# Altium project Sayma_AMC.PrjPcb (part 2 of 18)

## Sheet USB_SERIAL_QUAD.SchDoc: Sayma AMC
size 420 x 297 mm; $$Internal___BlkDate: 0:12:25_2-9-18; $$Internal_NAME_PLACEHOLDER: a3sheet; $$Internal_Resolution: 00001mm; $$NotCommonProperty_@NAME: USB_SERIAL_QUAD; $$NotCommonProperty_@PRINTORDER: 31; $$NotCommonProperty_@SHEET: 1; $$NotCommonProperty_@SHEETTOTAL: 30; CmpIndex: 15; Drawing Author: G.Kasprowicz; Drawing Number: Sayma AMC; Drawing Project: AMC FMC Carrier Board; Drawing Revision: 2.0; SymIndex: 2141; CheckedBy: P.Kulik,T.Przywozki,W.Ruclo; Author: G.Kasprowicz; CompanyName: WUT ISE; DrawnBy: G.Kasprowicz; Organization: WUT ISE; Address1: PW ISE; Address2: Nowowiejska 15/19 00-665 Warsaw; Address3: gkasprow@gmail.com; DocumentNumber: 20; Revision: 2; SheetNumber: 20; SheetTotal: 32; ModifiedBy: -; CheckedDate: -; Title2: Quad USB - serial; DivGrp: WUT ISE; Designer: G.Kasprowicz; ModifiedDate: -; ProjectName: Sensor Box
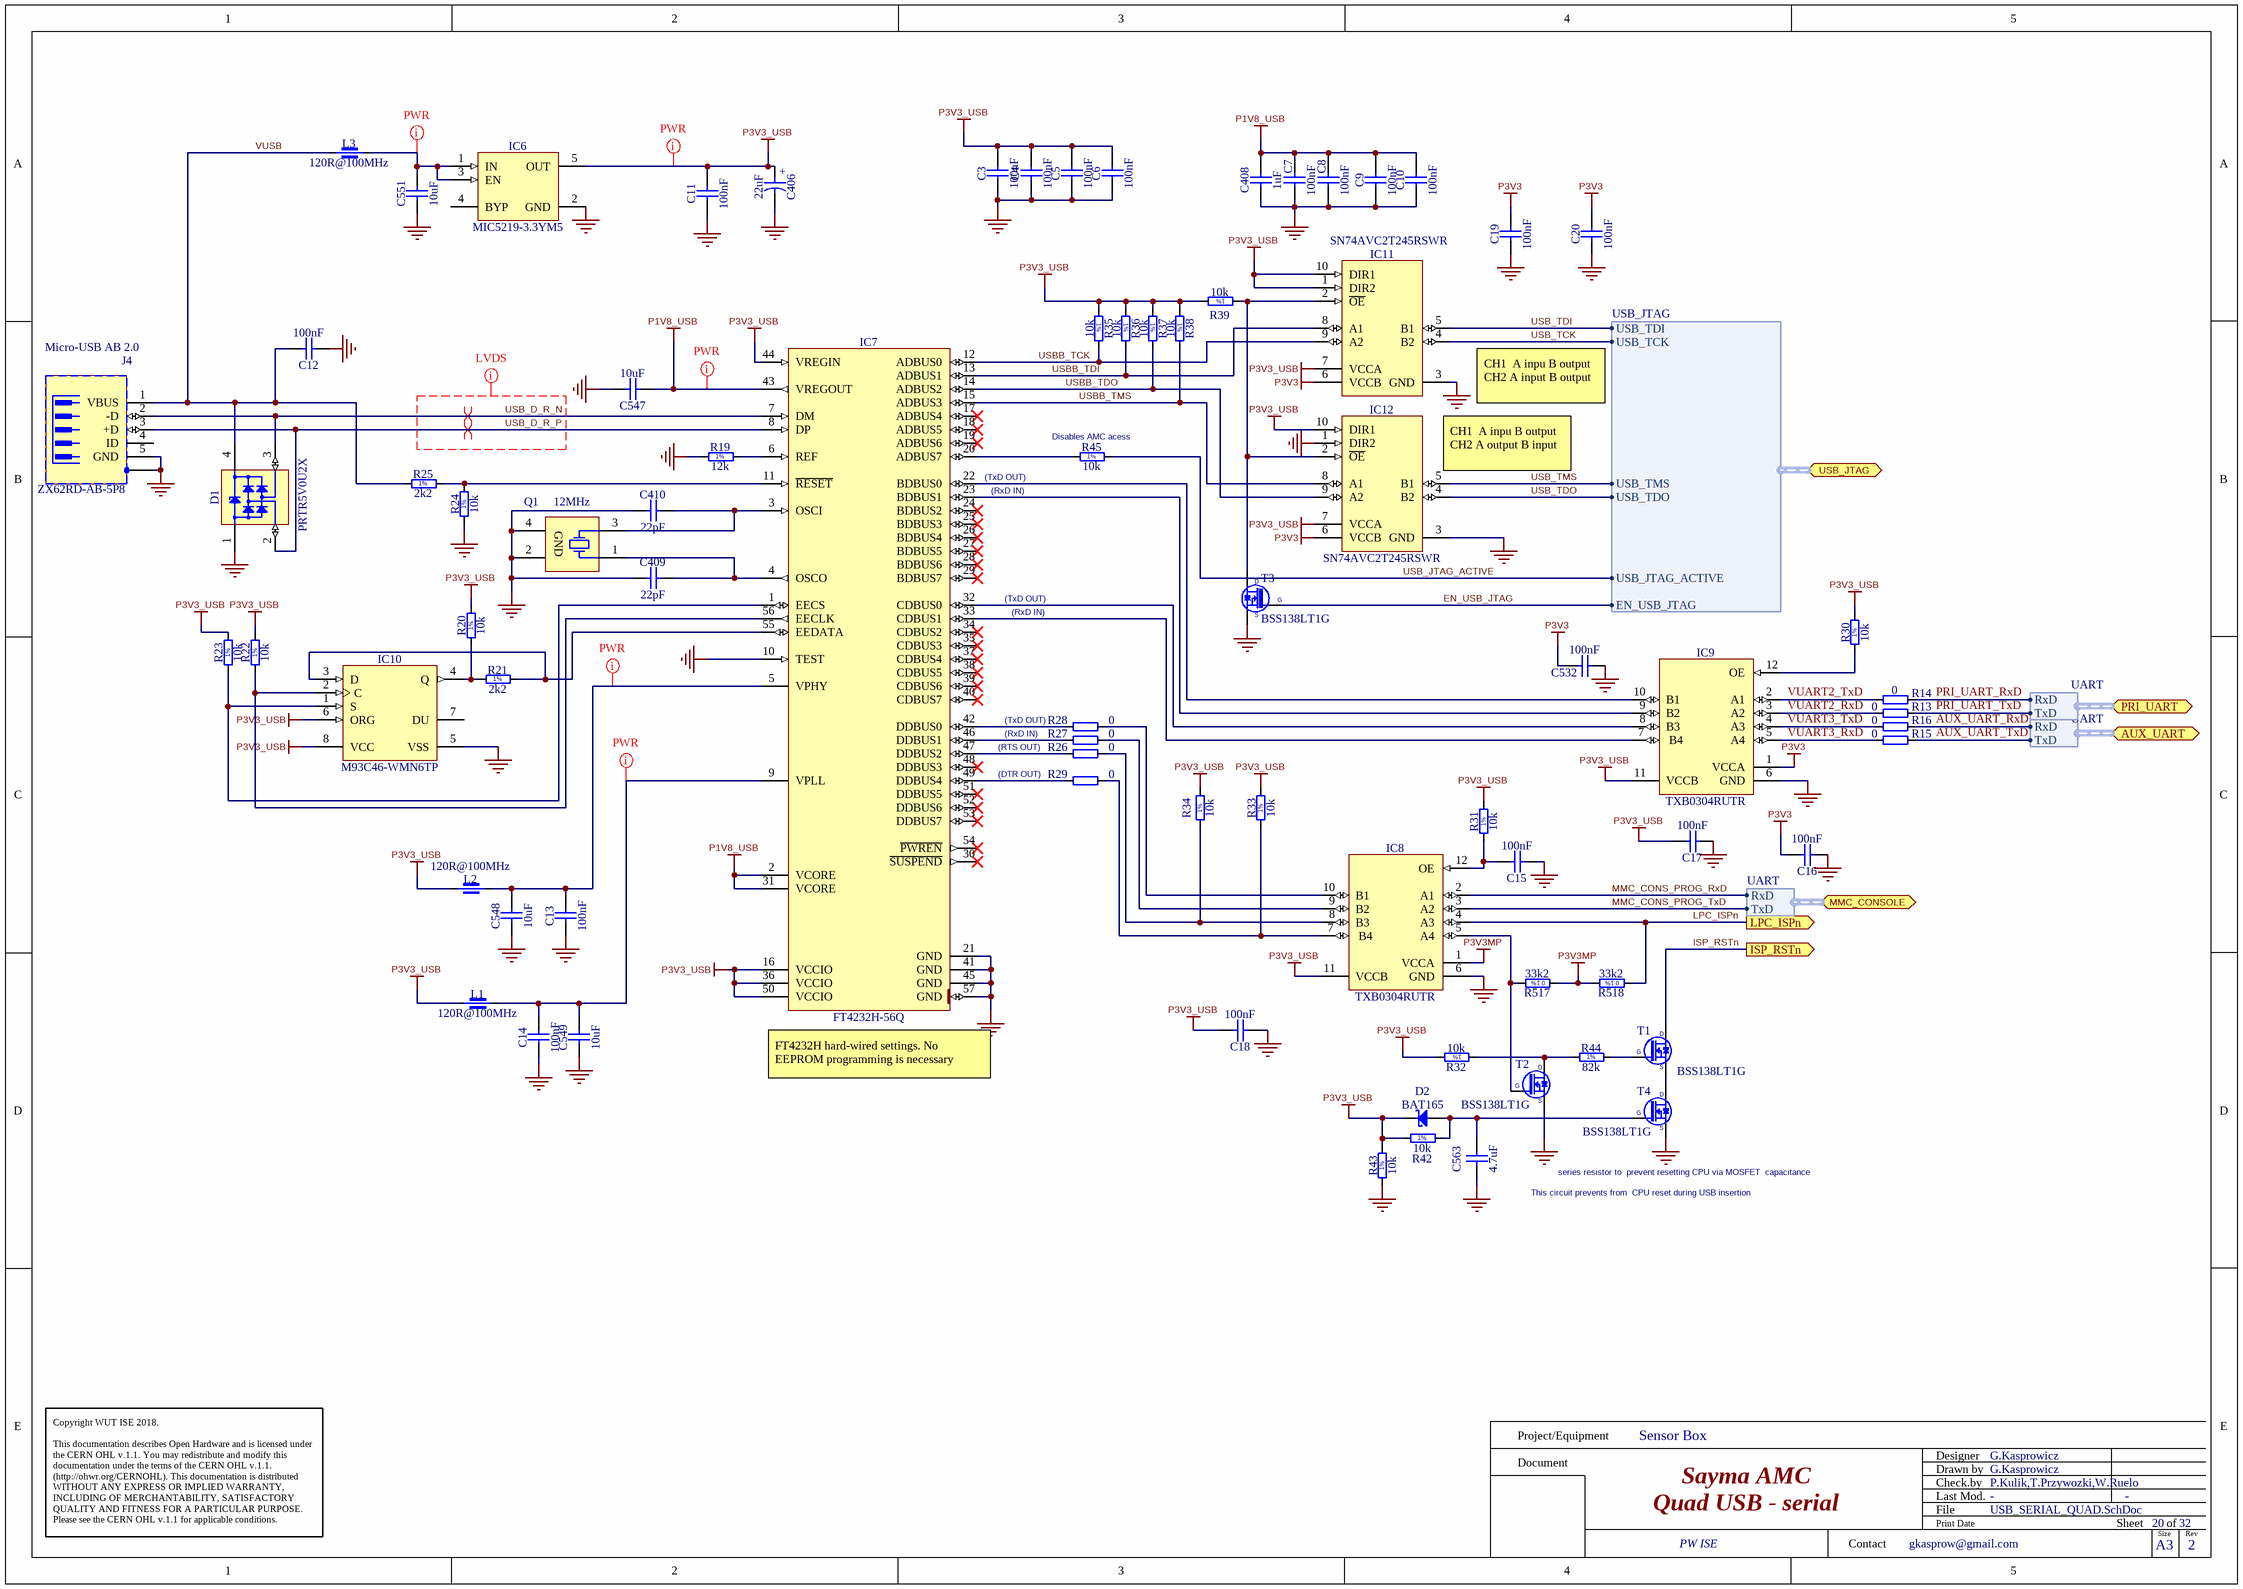
[diagram p1: USB_SERIAL_QUAD.SchDoc]

### Parts
C3  100nF  [CAPC0603X33N]
C4  100nF  [CAPC0603X33N]
C5  100nF  [CAPC0603X33N]
C6  100nF  [CAPC0603X33N]
C7  100nF  [CAPC0603X33N]
C8  100nF  [CAPC0603X33N]
C9  100nF  [CAPC0603X33N]
C10  100nF  [CAPC0603X33N]
C11  100nF  [CAPC0603X33N]
C12  100nF  [CAPC0603X33N]
C13  100nF  [CAPC0603X33N]
C14  100nF  [CAPC0603X33N]
C15  100nF  [CAPC0603X33N]
C16  100nF  [CAPC0603X33N]
C17  100nF  [CAPC0603X33N]
C18  100nF  [CAPC0603X33N]
C19  100nF  [CAPC0603X33N]
C20  100nF  [CAPC0603X33N]
C406  22uF  [CAPMP3216X180N]
C408  1uF  [CAPC1005X55N]
C409  22pF  [CAPC1005X55N]
C410  22pF  [CAPC1005X55N]
C532  100nF  [CAPC0603X33N]
C547  10uF  [CAPC1608X87N]
C548  10uF  [CAPC1608X87N]
C549  10uF  [CAPC1608X87N]
C551  10uF  [CAPC1608X87N]
C563  4.7uF  [CAPC1709X95N]
D1  PRTR5V0U2X  [SOT190P230X110-4N]
D2  BAT165  [SOD2512X110N]
IC6  MIC5219-3.3YM5  [SOT95P280X145-5N]
IC7  FT4232H-56Q  [QFN50P800X800X100-57N-S620]
IC8  TXB0304RUTR  [TEXAS_RUT (R-PUQFN-N12)]
IC9  TXB0304RUTR  [TEXAS_RUT (R-PUQFN-N12)]
IC10  M93C46-WMN6TP  [SOIC127P600X175-8N]
IC11  SN74AVC2T245RSWR  [QFN40P140X180X55-10N]
IC12  SN74AVC2T245RSWR  [QFN40P140X180X55-10N]
J4  Micro-USB AB 2.0  Manufacturer Part Number: ZX62RD-AB-5P8  [HIROSE_ZX62RD-AB-5P8]
L1  120R@100MHz  [INDC1608X65N]
L2  120R@100MHz  [INDC1608X65N]
L3  120R@100MHz  [INDC1608X65N]
Q1  12MHz  [XTAL_TXC_7M]
R13  0  [RESC1005X40N]
R14  0  [RESC1005X40N]
R15  0  [RESC1005X40N]
R16  0  [RESC1005X40N]
R19  12k  [RESC1005X40N]
R20  10k  [RESC1005X40N]
R21  2k2  [RESC1005X40N]
R22  10k  [RESC1005X40N]
R23  10k  [RESC1005X40N]
R24  10k  [RESC1005X40N]
R25  2k2  [RESC1005X40N]
R26  0  [RESC1005X40N]
R27  0  [RESC1005X40N]
R28  0  [RESC1005X40N]
R29  0  [RESC1005X40N]
R30  10k  [RESC1005X40N]
R31  10k  [RESC1005X40N]
R32  10k  [RESC1005X40N]
R33  10k  [RESC1005X40N]
R34  10k  [RESC1005X40N]
R35  10k  [RESC1005X40N]
R36  10k  [RESC1005X40N]
R37  10k  [RESC1005X40N]
R38  10k  [RESC1005X40N]
R39  10k  [RESC1005X40N]
R42  10k  [RESC1005X40N]
R43  10k  [RESC1005X40N]
R44  82k  [RESC1005X40N]
R45  10k  [RESC1005X40N]
R517  33k2  [RESC1608X55N]
R518  33k2  [RESC1608X55N]
T1  BSS138LT1G  [SOT95P240X110-3N]
T2  BSS138LT1G  [SOT95P240X110-3N]
T3  BSS138LT1G  [SOT95P240X110-3N]
T4  BSS138LT1G  [SOT95P240X110-3N]

### Ports
AUX_UART (bidir, harness UART), ISP_RSTn (out), LPC_ISPn (out), MMC_CONSOLE (bidir, harness UART), PRI_UART (bidir, harness UART), USB_JTAG (bidir, harness USB_JTAG)

### Harnesses
UART: RxD, TxD
USB_JTAG: USB_TDI, USB_TCK, USB_TMS, USB_TDO, USB_JTAG_ACTIVE, EN_USB_JTAG

### Nets
GND: C3.1 C4.1 C5.1 C6.1 C7.1 C8.1 C9.1 C10.1 C11.1 C12.1 C13.1 C14.1 C15.1 C16.1 C17.1 C18.1 C19.1 C20.1 C406.2 C408.2 C409.1 C410.1 C532.1 C547.2 C548.1 C549.1 C551.1 C563.1 D1.1(GND) IC6.2(GND) IC7.10(TEST) IC7.21(GND) IC7.41(GND) IC7.45(GND) IC7.57(GND) IC8.6(GND) IC9.6(GND) IC10.5(VSS) IC11.3(GND) IC12.1(DIR2) IC12.3(GND) J4.5(GND) J4.6(SH) Q1.2(GND) Q1.4(GND) R19.1 R24.1 R43.1 T2.2(S) T3.2(S) T4.2(S)
P1V8_USB: C7.2 C8.2 C9.2 C10.2 C408.1 C547.1 IC7.2(VCORE) IC7.31(VCORE) IC7.43(VREGOUT)
P3V3: C16.2 C19.2 C20.2 C532.2 IC9.1(VCCA) IC11.6(VCCB) IC12.6(VCCB)
P3V3_USB: C3.2 C4.2 C5.2 C6.2 C11.2 C17.2 C18.2 C406.1 D2.1(C) IC6.5(OUT) IC7.16(VCCIO) IC7.36(VCCIO) IC7.44(VREGIN) IC7.50(VCCIO) IC8.11(VCCB) IC9.11(VCCB) IC10.6(ORG) IC10.8(VCC) IC11.1(DIR2) IC11.7(VCCA) IC11.10(DIR1) IC12.7(VCCA) IC12.10(DIR1) L1.1 L2.1 R20.2 R22.2 R23.2 R30.2 R31.2 R32.2 R33.2 R34.2 R35.1 R36.1 R37.1 R38.1 R39.2 R42.1 R43.2
P3V3MP: IC8.1(VCCA) R517.1 R518.2
AUX_UART_RxD: R16.1 ; port AUX_UART.RxD
AUX_UART_TxD: R15.1 ; port AUX_UART.TxD
EN_USB_JTAG: T3.1(G) ; port USB_JTAG.EN_USB_JTAG
ISP_RSTn: T1.3(D) ; port ISP_RSTn
LPC_ISPn: IC8.4(A3) R518.1 ; port LPC_ISPn
MMC_CONS_PROG_RxD: IC8.2(A1) ; port MMC_CONSOLE.RxD
MMC_CONS_PROG_TxD: IC8.3(A2) ; port MMC_CONSOLE.TxD
PRI_UART_RxD: R14.1 ; port PRI_UART.RxD
PRI_UART_TxD: R13.1 ; port PRI_UART.TxD
USB_D_R_N: D1.3(I/O2) IC7.7(DM) J4.2(-D)
USB_D_R_P: D1.2(I/O1) IC7.8(DP) J4.3(+D)
USB_JTAG_ACTIVE: R45.2 ; port USB_JTAG.USB_JTAG_ACTIVE
USB_TCK: IC11.4(B2) ; port USB_JTAG.USB_TCK
USB_TDI: IC11.5(B1) ; port USB_JTAG.USB_TDI
USB_TDO: IC12.4(B2) ; port USB_JTAG.USB_TDO
USB_TMS: IC12.5(B1) ; port USB_JTAG.USB_TMS
USBB_TCK: IC7.12(ADBUS0) IC11.9(A2) R35.2
USBB_TDI: IC7.13(ADBUS1) IC11.8(A1) R36.2
USBB_TDO: IC7.14(ADBUS2) IC12.9(A2) R37.2
USBB_TMS: IC7.15(ADBUS3) IC12.8(A1) R38.2
VUART2_RxD: IC9.3(A2) R13.2
VUART2_TxD: IC9.2(A1) R14.2
VUART3_RxD: IC9.5(A4) R15.2
VUART3_TxD: IC9.4(A3) R16.2
VUSB: C12.2 D1.4(VCC) J4.1(VBUS) L3.1 R25.1
NetC13_2: C13.2 C548.2 IC7.5(VPHY) L2.2
NetC14_2: C14.2 C549.2 IC7.9(VPLL) L1.2
NetC15_2: C15.2 IC8.12(OE) R31.1
NetC409_2: C409.2 IC7.4(OSCO) Q1.1(X)
NetC410_2: C410.2 IC7.3(OSCI) Q1.3(X)
NetC551_2: C551.2 IC6.1(IN) IC6.3(EN) L3.2
NetC563_2: C563.2 D2.2(A) R42.2 T4.1(G)
NetIC7_1: IC7.1(EECS) IC10.1(S) R23.1
NetIC7_6: IC7.6(REF) R19.2
NetIC7_11: IC7.11(~{RESET}) R24.2 R25.2
NetIC7_20: IC7.20(ADBUS7) R45.1
NetIC7_22: IC7.22(BDBUS0) IC9.10(B1)
NetIC7_23: IC7.23(BDBUS1) IC9.9(B2)
NetIC7_32: IC7.32(CDBUS0) IC9.8(B3)
NetIC7_33: IC7.33(CDBUS1) IC9.7(B4)
NetIC7_42: IC7.42(DDBUS0) R28.1
NetIC7_46: IC7.46(DDBUS1) R27.1
NetIC7_47: IC7.47(DDBUS2) R26.1
NetIC7_49: IC7.49(DDBUS4) R29.1
NetIC7_55: IC7.55(EEDATA) IC10.3(D) R21.2
NetIC7_56: IC7.56(EECLK) IC10.2(C) R22.1
NetIC8_5: IC8.5(A4) R517.2 T2.1(G)
NetIC8_7: IC8.7(B4) R29.2 R33.1
NetIC8_8: IC8.8(B3) R26.2 R34.1
NetIC8_9: IC8.9(B2) R27.2
NetIC8_10: IC8.10(B1) R28.2
NetIC9_12: IC9.12(OE) R30.1
NetIC10_4: IC10.4(Q) R20.1 R21.1
NetIC11_2: IC11.2(~{OE}) IC12.2(~{OE}) R39.1 T3.3(D)
NetR32_1: R32.1 R44.1 T2.3(D)
NetR44_2: R44.2 T1.1(G)
NetT1_2: T1.2(S) T4.3(D)

Not connected (* = marked no-connect by the designer): IC6 4(BYP); IC7 17(ADBUS4)* 18(ADBUS5)* 19(ADBUS6)* 24(BDBUS2)* 25(BDBUS3)* 26(BDBUS4)* 27(BDBUS5)* 28(BDBUS6)* 29(BDBUS7)* 30(~{SUSPEND})* 34(CDBUS2)* 35(CDBUS3)* 37(CDBUS4)* 38(CDBUS5)* 39(CDBUS6)* 40(CDBUS7)* 48(DDBUS3)* 51(DDBUS5)* 52(DDBUS6)* 53(DDBUS7)* 54(~{PWREN})*; IC10 7(DU); J4 4(ID)

### Layout directives
net class PWR: NetC13_2, NetC14_2, NetC551_2, P1V8_USB, P3V3_USB
differential pair: USB_D_R_N, USB_D_R_P
net class LVDS: USB_D_R_N, USB_D_R_P

### Notes on the sheet
- CH1  A inpu B output
  CH2 A input B output
- (near R45) Disables AMC acess
- (near IC7) (TxD OUT)
- (RxD IN)
- (near IC12) CH1  A inpu B output
  CH2 A output B input
- (TxD OUT)
- (DTR OUT)
- (RTS OUT)
- (near IC7) FT4232H hard-wired settings. No EEPROM programming is necessary
- This circuit prevents from  CPU reset during USB insertion
- (near T4) series resistor to  prevent resetting CPU via MOSFET  capacitance
- Project/Equipment
- Document
- Designer
- Drawn by
- Check.by
- Copyright WUT ISE 2018.
  This documentation describes Open Hardware and is licensed under the CERN OHL v.1.1. You may redistribute and modify this documentation under the terms of the CERN OHL v.1.1. (http://ohwr.org/CERNOHL). This documentation is distributed WITHOUT ANY EXPRESS OR IMPLIED WARRANTY, INCLUDING OF MERCHANTABILITY, SATISFACTORY QUALITY AND FITNESS FOR A PARTICULAR PURPOSE. Please see the CERN OHL v.1.1 for applicable conditions.
- Contact
- File
- Last Mod.
- Print Date
- Sheet
- Size
- A3
- of
- Rev
- (in symbol CTE3216-18_22UF_6.3V_10%_LESR0900) +
- (in symbol R0402_2K2_1%_0.0625W_100PPM) 1%
- (in symbol R0402_10K_1%_0.0625W_100PPM) 1%
- (in symbol R0402_12K_1%_0.0625W_100PPM) 1%
- (in symbol R0402_82K_1%_0.0625W_100PPM) 1%
- (in symbol R0603_33K2_0.1%_0.063W_10PPM) 0.1%

### Library data of the parts
C3-C20 C532 = CC0201_100NF_6.3V_10%_X5R: Non-polarised capacitor; Manufacturer: GENERIC; Part Description: SMD Multilayer Chip Ceramic Capacitor; Manufacturer1 Part Number: 02016D104KAT2A; Tolerance: ±10%; Voltage: 6.3V; TC: X5R; Manufacturer Part Number: CC0201_100NF_6.3V_10%_X5R; Part Number: CC0201_100NF_6.3V_10%_X5R; Value: 100nF; Component Kind: Standard; Component Type: Standard; Pin Count: 2; Status: Not Recommended; Case: 0201; Mounted: Yes; Socket: No; SMD: Yes; Sense: No; Manufacturer1 Example: AVX; Manufacturer1 ComponentHeight: 0.33mm; HelpURL: \\cern.ch\dfs\Applications\Altium\Datasheets\CC0201_X5R_AVX.pdf; Author: CERN DEM JLC; CreateDate: 03.12.2007; LatestRevisionDate: 03.12.2007
C406 = CTE3216-18_22UF_6.3V_10%_LESR0900: Polarised capacitor; Manufacturer: GENERIC; Part Description: Low ESR 0R9 Solid Tantalum Chip Capacitor; Manufacturer1 Part Number: TPSA226K006R0900; Tolerance: ±10%; Voltage: 6.3V; Manufacturer Part Number: CTE3216-18_22UF_6.3V_10%_LESR0900; Part Number: CTE3216-18_22UF_6.3V_10%_LESR0900; Value: 22uF; Component Kind: Standard; Component Type: Standard; Pin Count: 2; Status: Preferred; Case: A; Mounted: Yes; Socket: No; SMD: Yes; Sense: No; Manufacturer1 Example: AVX; Manufacturer1 ComponentHeight: 1.8mm; HelpURL: \\cern.ch\dfs\Applications\Altium\Datasheets\CTE-LESR_AVX_TPS.pdf; Author: CERN DEM JLC; CreateDate: 05.05.2008; LatestRevisionDate: 20.01.2009
C408 = CC0402_1UF_16V_10%_X5R: Non-polarised capacitor; Manufacturer: GENERIC; Part Description: SMD Multilayer Chip Ceramic Capacitor; Manufacturer1 Part Number: C1005X5R1C105KT; Tolerance: ±10%; Voltage: 16V; TC: X5R; Manufacturer Part Number: CC0402_1UF_16V_10%_X5R; Part Number: CC0402_1UF_16V_10%_X5R; Value: 1uF; Component Kind: Standard; Component Type: Standard; Pin Count: 2; Status: Preferred; Case: 0402; Mounted: Yes; Socket: No; SMD: Yes; Sense: No; Manufacturer1 Example: TDK; Manufacturer1 ComponentHeight: 0.55mm; HelpURL: \\cern.ch\dfs\Applications\Altium\Datasheets\CC0402_X5R_TDK_C.pdf; Author: CERN DEM JLC; CreateDate: 25.10.2012; LatestRevisionDate: 25.10.2012
C409 C410 = CC0402_22PF_50V_5%_C0G: Non-polarised capacitor; Manufacturer: GENERIC; Part Description: SMD Multilayer Chip Ceramic Capacitor; Manufacturer1 Part Number: C0402C220J5GACTU; Tolerance: ±5%; Voltage: 50V; TC: C0G/NP0; Manufacturer Part Number: CC0402_22PF_50V_5%_C0G; Part Number: CC0402_22PF_50V_5%_C0G; Value: 22pF; Component Kind: Standard; Component Type: Standard; Pin Count: 2; Status: Preferred; Case: 0402; Mounted: Yes; Socket: No; SMD: Yes; Sense: No; Manufacturer1 Example: KEMET; Manufacturer1 ComponentHeight: 0.55mm; HelpURL: \\cern.ch\dfs\Applications\Altium\Datasheets\CC0805_C0G_KEMET_(Commercial Grade).pdf; Author: CERN DEM JLC; CreateDate: 03.12.2007; LatestRevisionDate: 03.12.2007
C547-C549 C551 = CC0603_10UF_6.3V_20%_X5R: Non-polarised capacitor; Manufacturer: GENERIC; Part Description: SMD Multilayer Chip Ceramic Capacitor; Manufacturer1 Part Number: C0603C106M9PAC; Tolerance: ±20%; Voltage: 6.3V; TC: X5R; Manufacturer Part Number: CC0603_10uF_6.3V_20%_X5R; Part Number: CC0603_10UF_6.3V_20%_X5R; Value: 10uF; Component Kind: Standard; Component Type: Standard; Pin Count: 2; Status: Preferred; Case: 0603; Mounted: Yes; Socket: No; SMD: Yes; Sense: No; Manufacturer1 Example: KEMET; Manufacturer1 ComponentHeight: 0.95mm; HelpURL: \\cern.ch\dfs\Applications\Altium\Datasheets\CC0603_X5R_KEMET.pdf; Author: CERN DEM JLC; CreateDate: 03.12.2007; LatestRevisionDate: 03.12.2007
C563 = CC0603_4.7UF_16V_10%_X5R: Non-polarised capacitor; Manufacturer: GENERIC; Part Description: SMD Multilayer Chip Ceramic Capacitor; Manufacturer1 Part Number: EMK107ABJ475KA-T; Tolerance: ±10%; Voltage: 16V; TC: X5R; Manufacturer Part Number: CC0603_4.7UF_16V_10%_X5R; Part Number: CC0603_4.7UF_16V_10%_X5R; Value: 4.7uF; Component Kind: Standard; Component Type: Standard; Pin Count: 2; Status: None; Case: 0603; Mounted: Yes; Socket: No; SMD: Yes; Sense: No; Manufacturer1 Example: TAIYO YUDEN; Manufacturer1 ComponentHeight: 0.95mm; HelpURL: \\cern.ch\dfs\Applications\Altium\Datasheets\CC0603_X7R_TAIYO-YUDEN_HIGH-VALUE.pdf; Author: CERN DEM JLC; CreateDate: 16.12.2013; LatestRevisionDate: 16.09.2014
D1 = PRTR5V0U2X: Ultra Low Capacitance Double Rail-to-Rail ESD Protection Diode; Manufacturer: NXP SEMICONDUCTORS; Part Description: Ultra Low Capacitance (1pF) Double Rail-to-Rail ESD Protection Diode (8kV); Voltage: 5.5V; PressFit: No; Bonding: No; Manufacturer Part Number: PRTR5V0U2X; PackageDescription: SOT143B, SOT, 1.90mm Pitch; 4 Pin, 1.30mm W X 2.90mm L X 1.10mm H body, IPC Medium Density; Part Number: PRTR5V0U2X; Component Kind: Standard; Component Type: Standard; Device: PRTR5V0U2X; Pin Count: 4; Case: SOT143B; Mounted: Yes; Socket: No; SMD: Yes; Sense: No; ComponentHeight: 1.1mm; HelpURL: \\cern.ch\dfs\Applications\Altium\Datasheets\PRTR5V0U2X.pdf; Author: CERN DEM JLC; CreateDate: 22.03.2011; LatestRevisionDate: 22.03.2011
D2 = BAT165: Schottky Diode; Manufacturer: INFINEON; Part Description: Medium Power AF Schottky Diode; Voltage: 40V; Power: 750mA; PressFit: No; Bonding: No; Manufacturer Part Number: BAT165; PackageDescription: Small Outline Diode (SOD-323), 1.70mm W X 1.25mm L X 1.10mm H body,  IPC Medium Density; Part Number: BAT165; Component Kind: Standard; Component Type: Standard; Device: BAT165; Pin Count: 2; Case: SOD323; Mounted: Yes; Socket: No; SMD: Yes; Sense: No; ComponentHeight: 1.1mm; HelpURL: \\cern.ch\dfs\Applications\Altium\Datasheets\BAT165.pdf; Author: CERN DEM JLC; CreateDate: 12.11.2014; LatestRevisionDate: 12.11.2014
IC6 = MIC5219-3.3YM5: 500mA Peak Output LDO Regulator; Part Description: 3.3V 500mA Peak Output Low Drop-Out  (LDO) Regulator; Manufacturer: MICROCHIP TECHNOLOGY; PressFit: No; Bonding: No; Part Number: MIC5219-3.3YM5; Component Kind: Standard; Component Type: Standard; Device: MIC5219-3.3YM5; PackageDescription: SOT, 0.95mm pitch; 5 pin, 1.60mm W X 2.90mm L X 1.45mm H body, IPC Medium Density; Manufacturer Part Number: MIC5219-3.3YM5; Pin Count: 5; Case: SOT23-5; Mounted: Yes; Socket: No; SMD: Yes; Sense: No; ComponentHeight: 1.45mm; HelpURL: \\cern.ch\dfs\Applications\Altium\Datasheets\MIC5219-3.3YM5.pdf; Author: CERN DEM WB; CreateDate: 16.04.2019; LatestRevisionDate: 16.04.2019
IC7 = FT4232H-56Q: Quad High Speed USB to Multipurpose UART/MPSSE IC; Manufacturer: FUTURE TECHNOLOGY DEVICES INTERNATIONAL (FTDI); PressFit: No; Bonding: No; Manufacturer Part Number: FT4232H-56Q; PackageDescription: QFN, 0.50mm Pitch, Square; 56 Pin, 8.00mm L X 8.00mm W X 1.00mm H body (6.1mm X 6.1mm Thermal tab), IPC Medium Density; Part Description: Quad High Speed USB to Multipurpose UART/MPSSE IC; Part Number: FT4232H-56Q; Component Kind: Standard; Component Type: Standard; Device: FT4232H-56Q; Pin Count: 57; Case: QFN56; Mounted: Yes; Socket: No; SMD: Yes; Sense: No; ComponentHeight: 1mm; Author: CERN DEM JLC; HelpURL: \\cern.ch\dfs\Applications\Altium\Datasheets\FT4232H-56Q.pdf; CreateDate: 11.10.2016; LatestRevisionDate: 11.10.2016
IC8 IC9 = TXB0304RUTR: 4-bit Bidirectional Auto-direction Sensing Translator with Fully Symmetric 0.9V to 3.6V Range; Manufacturer: TEXAS INSTRUMENTS; PressFit: No; Bonding: No; Manufacturer Part Number: TXB0304RUTR; PackageDescription: SON, TEXAS RUT (R-PUQFN-N12), 0.50mm Pitch, 12-pin, 1.70mm W  X 2.00mm L X 0.55mm Height; Part Description: 4-bit Bidirectional Auto-direction Sensing Translator with Fully Symmetric 0.9V to 3.6V Range; Part Number: TXB0304RUTR; Component Kind: Standard; Component Type: Standard; Device: TXB0304RUTR; Pin Count: 12; Case: QFN12; Mounted: Yes; Socket: No; SMD: Yes; Sense: No; ComponentHeight: 0.55mm; Author: CERN DEM JLC; HelpURL: \\cern.ch\dfs\Applications\Altium\Datasheets\TXB0304RUTR.pdf; CreateDate: 27.10.2014; LatestRevisionDate: 28.10.2014
IC10 = M93C46-WMN6TP: 2.5 to 5.5 V, 1Kb (128x8) Serial Microwire Bus EEPROM; Manufacturer: ST MICROELECTRONICS; Part Description: 1Kbit (128 x 8 bit or 64 x 16 bit) MICROWIRE® Serial Access EEPROM; PressFit: No; Bonding: No; Manufacturer Part Number: M93C46-WMN6TP; PackageDescription: SOIC 8, Pitch 1.27mm - Body 4x5mm, IPC Medium Density; Part Number: M93C46-WMN6TP; Component Kind: Standard; Component Type: Standard; Device: M93C46-WMN6TP; Pin Count: 8; Case: SOIC8; Mounted: Yes; Socket: No; SMD: Yes; Sense: No; ComponentHeight: 1.75mm; HelpURL: \\cern.ch\dfs\Applications\Altium\Datasheets\M93C46-WMN6TP.pdf; Author: CERN DEM JLC; CreateDate: 15.11.2012; LatestRevisionDate: 15.11.2012
IC11 IC12 = SN74AVC2T245RSWR: Dual-Bit Dual-Supply Bus Transceiver With Configurable Voltage Translation and 3-State Outputs; Manufacturer: TEXAS INSTRUMENTS; PressFit: No; Bonding: No; Manufacturer Part Number: SN74AVC2T245RSWR; PackageDescription: QFN, 0.40mm Pitch, Rect.;10 Pin, 1.80mm L X 1.40mm W X 0.55mm H Body, IPC Medium Density; Part Description: Dual-Bit Dual-Supply Bus Transceiver With Configurable Voltage Translation and 3-State Outputs; Part Number: SN74AVC2T245RSWR; Component Kind: Standard; Component Type: Standard; Device: SN74AVC2T245RSWR; Status: Not Recommended; Pin Count: 10; Case: QFN10; Mounted: Yes; Socket: No; SMD: Yes; Sense: No; ComponentHeight: 0.55mm; Author: CERN DEM JLC; HelpURL: \\cern.ch\dfs\Applications\Altium\Datasheets\SN74AVC2T245RSWR.pdf; CreateDate: 07.07.2014; LatestRevisionDate: 30.03.2017
J4 = HIROSE_ZX62RD-AB-5P8: 5 Pin + 1 Shield USB Receptacle; Manufacturer: HIROSE (HRS); Part Description: Micro-USB 2.0 Right Angle, SMD Type AB - Reverse (Top mount), Shell Through Hole; PressFit: No; Part Number: HIROSE_ZX62RD-AB-5P8; Component Kind: Standard; Component Type: Standard; Pin Count: 7; Family: Micro-USB AB 2.0; Mounted: Yes; Socket: No; SMD: Yes; Sense: No; Status: Obsolete; ComponentHeight: 2.35mm; HelpURL: \\cern.ch\dfs\Applications\Altium\Datasheets\HIROSE_ZX62RD-AB-5P8.pdf; ComponentLink1URL: \\cern.ch\dfs\Applications\Altium\Datasheets\HIROSE_ZX62RD-AB-5P8_Package-Drawing.pdf; ComponentLink1Description: Package-Drawing; Author: CERN DEM JLC; CreateDate: 29.10.2014; LatestRevisionDate: 22.06.2017
L1-L3 = IND0603_MURATA_BLM18SG121TN1D: Manufacturer: MURATA; Part Description: SMD EMIFIL Suppression Chip Ferrite Bead; Tolerance: ±25%; Power: 3A; Resistance: 0.025R; Manufacturer Part Number: BLM18SG121TN1D; Part Number: IND0603_MURATA_BLM18SG121TN1D; Value: 120R@100MHz; Component Kind: Standard; Component Type: Standard; Pin Count: 2; Status: None; Case: 0603; Mounted: Yes; Socket: No; SMD: Yes; Sense: No; ComponentHeight: 0.65mm; HelpURL: \\cern.ch\dfs\Applications\Altium\Datasheets\IND0603_MURATA_BLM18S.pdf; Author: CERN DEM JLC; CreateDate: 23.07.2014; LatestRevisionDate: 25.10.2018
Q1 = XTAL_12MHZ_TXC_7M-12.000MAAJ-T: Crystal 4 pins 1=XTAL Control 2=GND3=XTAL 4=GND; Manufacturer: TXC CORPORATION; Part Description: ±30ppm 18pF -20°C to +70°C  4 Pins, 3.2x2.5X0.8mm, SMD Sealing Crystal, 7M Series; PressFit: No; Bonding: No; Manufacturer Part Number: 7M-12.000MAAJ-T; PackageDescription: 4 Pins, 2.5x3.2mm, SMD Sealing Crystal, 7M Serie; Part Number: XTAL_12MHZ_TXC_7M-12.000MAAJ-T; Value: 12MHz; Component Kind: Standard; Component Type: Standard; Pin Count: 4; Mounted: Yes; Socket: No; SMD: Yes; Sense: No; ComponentHeight: 0.8mm; HelpURL: \\cern.ch\dfs\Applications\Altium\Datasheets\XTAL_TXC_7M.pdf; Author: CERN DEM JLC; CreateDate: 19.06.2012; LatestRevisionDate: 19.06.2012
R13-R16 R26-R29 = R0402_0R_JUMPER: as R1 on sheet Sayma_AMC; Manufacturer Part Number: R0402_0R_JUMPER; Part Number: R0402_0R_JUMPER; Value: 0; Component Kind: Standard; Component Type: Standard; Pin Count: 2; Status: Not Recommended; Case: 0402; Mounted: Yes; Sense: No; Socket: No; SMD: Yes; Manufacturer1 Example: YAGEO PHYCOMP; Manufacturer1 ComponentHeight: 0.4mm; HelpURL: \\cern.ch\dfs\Applications\Altium\Datasheets\R0402_Phycomp_RC0402.pdf; Author: CERN DEM JLC; CreateDate: 03.12.2007; LatestRevisionDate: 17.10.2012
R19 = R0402_12K_1%_0.0625W_100PPM: Resistor - 1%; Manufacturer: GENERIC; Part Description: General Purpose Thick Film Chip Resistor; Manufacturer1 Part Number: 232270671203L; TC: ±100ppm/°C; PressFit: No; Manufacturer Part Number: R0402_12K_1%_0.0625W_100PPM; Part Number: R0402_12K_1%_0.0625W_100PPM; Tolerance: ±1%; Value: 12k; Component Kind: Standard; Component Type: Standard; Pin Count: 2; Status: Not Recommended; Power: 0.0625W; Case: 0402; Mounted: Yes; Sense: No; Socket: No; SMD: Yes; Manufacturer1 Example: YAGEO PHYCOMP; Manufacturer1 ComponentHeight: 0.4mm; HelpURL: \\cern.ch\dfs\Applications\Altium\Datasheets\R0402_Phycomp_RC0402.pdf; Author: CERN DEM JLC; CreateDate: 03.12.2007; LatestRevisionDate: 17.10.2012
R20 R22-R24 R30-R39 R42 R43 R45 = R0402_10K_1%_0.0625W_100PPM: Resistor - 1%; Manufacturer: GENERIC; Part Description: General Purpose Thick Film Chip Resistor; Manufacturer1 Part Number: 232270671003L; TC: ±100ppm/°C; PressFit: No; Manufacturer Part Number: R0402_10K_1%_0.0625W_100PPM; Part Number: R0402_10K_1%_0.0625W_100PPM; Tolerance: ±1%; Value: 10k; Component Kind: Standard; Component Type: Standard; Pin Count: 2; Status: Not Recommended; Power: 0.0625W; Case: 0402; Mounted: Yes; Sense: No; Socket: No; SMD: Yes; Manufacturer1 Example: YAGEO PHYCOMP; Manufacturer1 ComponentHeight: 0.4mm; HelpURL: \\cern.ch\dfs\Applications\Altium\Datasheets\R0402_Phycomp_RC0402.pdf; Author: CERN DEM JLC; CreateDate: 03.12.2007; LatestRevisionDate: 17.10.2012
R21 R25 = R0402_2K2_1%_0.0625W_100PPM: Resistor - 1%; Manufacturer: GENERIC; Part Description: General Purpose Thick Film Chip Resistor; Manufacturer1 Part Number: 232270672202L; TC: ±100ppm/°C; PressFit: No; Manufacturer Part Number: R0402_2K2_1%_0.0625W_100PPM; Part Number: R0402_2K2_1%_0.0625W_100PPM; Tolerance: ±1%; Value: 2k2; Component Kind: Standard; Component Type: Standard; Pin Count: 2; Status: Not Recommended; Power: 0.0625W; Case: 0402; Mounted: Yes; Sense: No; Socket: No; SMD: Yes; Manufacturer1 Example: YAGEO PHYCOMP; Manufacturer1 ComponentHeight: 0.4mm; HelpURL: \\cern.ch\dfs\Applications\Altium\Datasheets\R0402_Phycomp_RC0402.pdf; Author: CERN DEM JLC; CreateDate: 03.12.2007; LatestRevisionDate: 17.10.2012
R44 = R0402_82K_1%_0.0625W_100PPM: Resistor - 1%; Manufacturer: GENERIC; Part Description: General Purpose Thick Film Chip Resistor; Manufacturer1 Part Number: 232270678203L; TC: ±100ppm/°C; PressFit: No; Manufacturer Part Number: R0402_82K_1%_0.0625W_100PPM; Part Number: R0402_82K_1%_0.0625W_100PPM; Tolerance: ±1%; Value: 82k; Component Kind: Standard; Component Type: Standard; Pin Count: 2; Status: Not Recommended; Power: 0.0625W; Case: 0402; Mounted: Yes; Sense: No; Socket: No; SMD: Yes; Manufacturer1 Example: YAGEO PHYCOMP; Manufacturer1 ComponentHeight: 0.4mm; HelpURL: \\cern.ch\dfs\Applications\Altium\Datasheets\R0402_Phycomp_RC0402.pdf; Author: CERN DEM JLC; CreateDate: 03.12.2007; LatestRevisionDate: 17.10.2012
R517 R518 = R0603_33K2_0.1%_0.063W_10PPM: Resistor - 0.1%; Manufacturer: GENERIC; Part Description: Thin Film Chip Resistor; Manufacturer1 Part Number: RN73C1J33K2BTDF; Power: 0.063W; TC: ±10ppm; PressFit: No; Manufacturer Part Number: R0603_33K2_0.1%_0.063W_10PPM; Part Number: R0603_33K2_0.1%_0.063W_10PPM; Tolerance: ±0.1%; Value: 33k2; Component Kind: Standard; Component Type: Standard; Pin Count: 2; Status: Not Recommended; Case: 0603; Mounted: Yes; Sense: No; Socket: No; SMD: Yes; Manufacturer1 Example: TYCO HOLSWORTHY; Manufacturer1 ComponentHeight: 0.5mm; HelpURL: \\cern.ch\dfs\Applications\Altium\Datasheets\R0603_Tyco_RN73.pdf; Author: CERN DEM JLC; CreateDate: 03.12.2007; LatestRevisionDate: 13.03.2008
T1-T4 = BSS138LT1G: N-CHANNEL MOSFET WITH DIODE; Manufacturer: ON SEMICONDUCTOR; Part Description: 50V 200mA N-Channel Enhancement Mode Field-Effect Transistor; PressFit: No; Bonding: No; Manufacturer Part Number: BSS138LT1G; PackageDescription: SOT23 3-Leads, Pitch 0.95mm - Body 1.4x3mm, IPC Medium Density; Part Number: BSS138LT1G; Component Kind: Standard; Component Type: Standard; Device: BSS138LT1G; Pin Count: 3; Case: SOT23-3; Mounted: Yes; Socket: No; SMD: Yes; Sense: No; ComponentHeight: 1.11mm; HelpURL: \\cern.ch\dfs\Applications\Altium\Datasheets\BSS138LT1G.pdf; Author: CERN DEM JLC; CreateDate: 23.03.2009; LatestRevisionDate: 23.03.2009

## Sheet AMC_Connector.SchDoc: Sayma AMC
size 420 x 297 mm; $$Internal___BlkDate: 0:12:25_2-9-18; $$Internal_NAME_PLACEHOLDER: a3sheet; $$Internal_Resolution: 00001mm; $$NotCommonProperty_@NAME: AMC_Connector; $$NotCommonProperty_@PRINTORDER: 7; $$NotCommonProperty_@SHEET: 1; $$NotCommonProperty_@SHEETTOTAL: 30; CmpIndex: 8; Drawing Author: G.Kasprowicz; Drawing Number: Sayma AMC; Drawing Project: AMC FMC Carrier Board; Drawing Revision: 2.0; SymIndex: 2141; CheckedBy: P.Kulik,T.Przywozki,W.Ruclo; Author: G.Kasprowicz; CompanyName: WUT ISE; DrawnBy: G.Kasprowicz; Organization: WUT ISE; Address1: PW ISE; Address2: Nowowiejska 15/19 00-665 Warsaw; Address3: gkasprow@gmail.com; DocumentNumber: 2; Revision: 2; SheetNumber: 2; SheetTotal: 32; ModifiedBy: -; CheckedDate: -; Title2: AMC connector; DivGrp: WUT ISE; Designer: G.Kasprowicz; ModifiedDate: -; ProjectName: Sensor Box
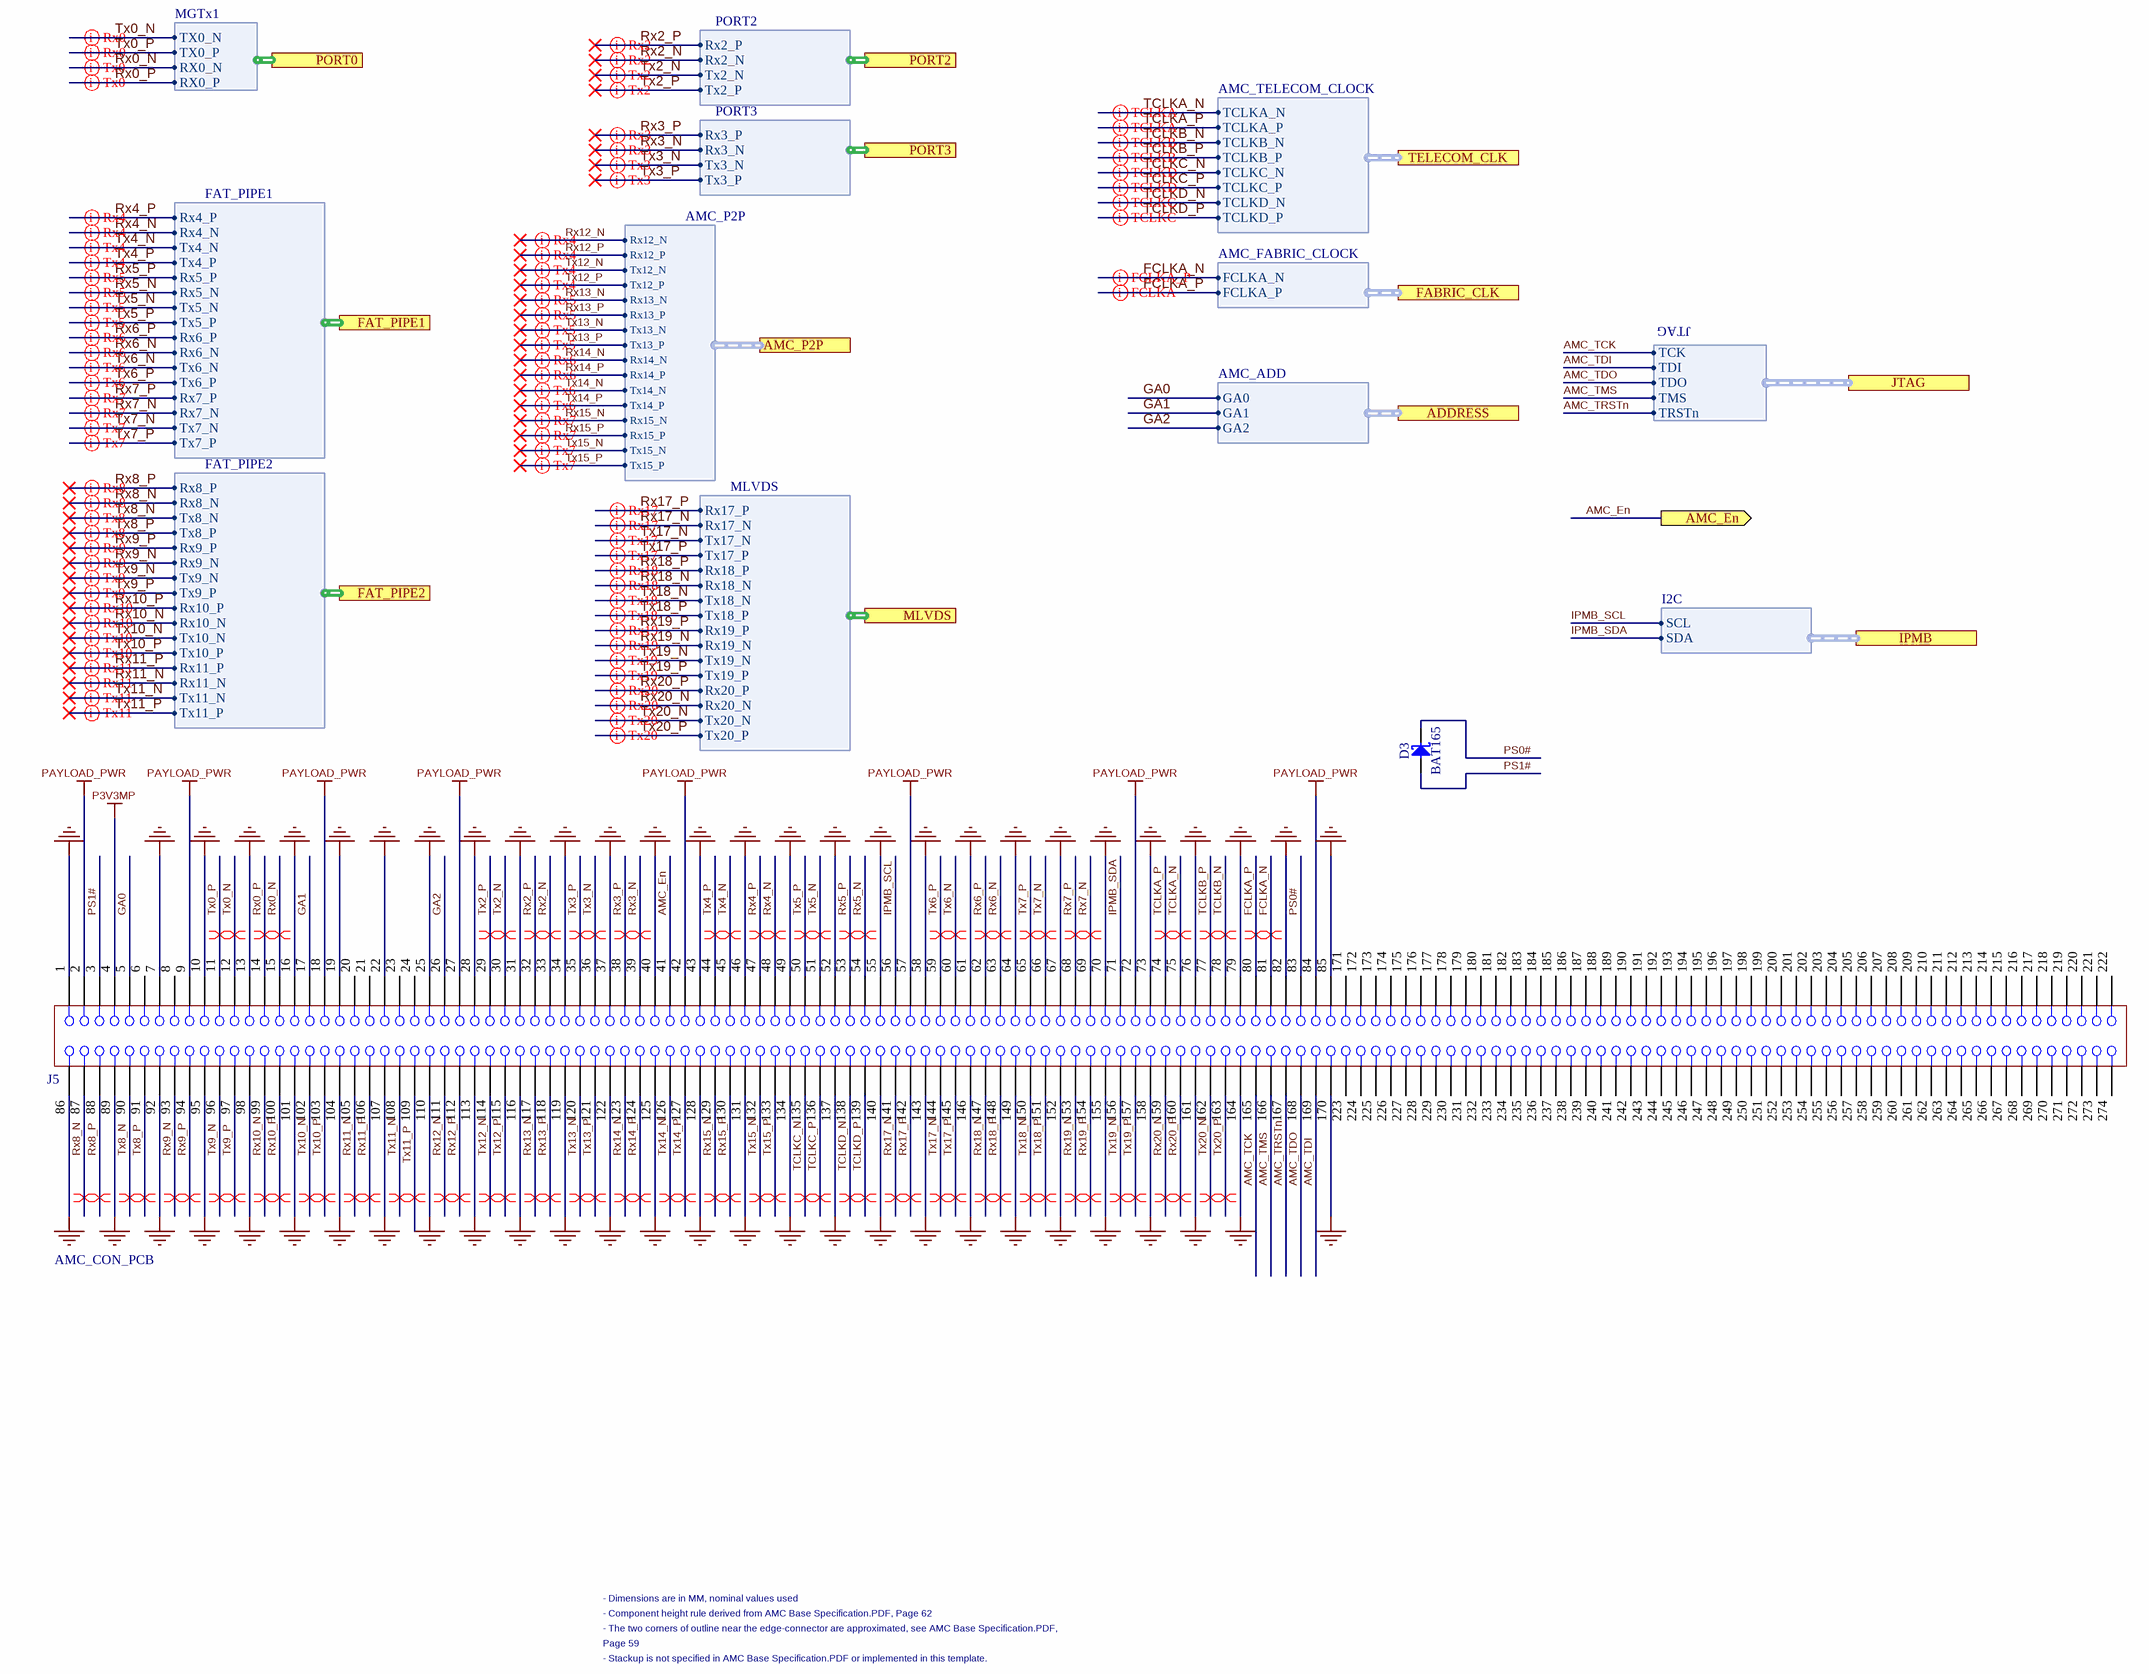
[diagram p2: AMC_Connector.SchDoc]

### Parts
D3  BAT165  [SOD2512X110N]
J5  AMC_CON_PCB

### Ports
ADDRESS (harness AMC_ADD), AMC_En (out), AMC_P2P (harness AMC_P2P), FABRIC_CLK (harness AMC_FABRIC_CLOCK), FAT_PIPE1 (harness FAT_PIPE1), FAT_PIPE2 (harness FAT_PIPE2), IPMB (harness I2C), JTAG (harness JTAG), MLVDS (harness MLVDS), PORT0 (harness MGTx1), PORT2 (harness PORT2), PORT3 (harness PORT3), TELECOM_CLK (harness AMC_TELECOM_CLOCK)

### Harnesses
FAT_PIPE1: Rx4_P, Rx4_N, Tx4_N, Tx4_P, Rx5_P, Rx5_N, Tx5_N, Tx5_P, Rx6_P, Rx6_N, Tx6_N, Tx6_P, Rx7_P, Rx7_N, Tx7_N, Tx7_P
FAT_PIPE2: Rx8_P, Rx8_N, Tx8_N, Tx8_P, Rx9_P, Rx9_N, Tx9_N, Tx9_P, Rx10_P, Rx10_N, Tx10_N, Tx10_P, Rx11_P, Rx11_N, Tx11_N, Tx11_P
MLVDS: Rx17_P, Rx17_N, Tx17_N, Tx17_P, Rx18_P, Rx18_N, Tx18_N, Tx18_P, Rx19_P, Rx19_N, Tx19_N, Tx19_P, Rx20_P, Rx20_N, Tx20_N, Tx20_P
PORT2: Rx2_P, Rx2_N, Tx2_N, Tx2_P
PORT3: Rx3_P, Rx3_N, Tx3_N, Tx3_P
AMC_P2P: Rx12_N, Rx12_P, Tx12_N, Tx12_P, Rx13_N, Rx13_P, Tx13_N, Tx13_P, Rx14_N, Rx14_P, Tx14_N, Tx14_P, Rx15_N, Rx15_P, Tx15_N, Tx15_P
AMC_TELECOM_CLOCK: TCLKA_N, TCLKA_P, TCLKB_N, TCLKB_P, TCLKC_N, TCLKC_P, TCLKD_N, TCLKD_P
AMC_FABRIC_CLOCK: FCLKA_N, FCLKA_P
AMC_ADD: GA0, GA1, GA2
I2C: SCL, SDA
JTAG: TCK, TDI, TDO, TMS, TRSTn
MGTx1: RX0_P, RX0_N, TX0_P, TX0_N

### Nets
GND: J5.1 J5.7 J5.10 J5.13 J5.16 J5.19 J5.22 J5.25 J5.28 J5.31 J5.34 J5.37 J5.40 J5.43 J5.46 J5.49 J5.52 J5.55 J5.58 J5.61 J5.64 J5.67 J5.70 J5.73 J5.76 J5.79 J5.82 J5.85 J5.86 J5.89 J5.92 J5.95 J5.98 J5.101 J5.104 J5.107 J5.110 J5.113 J5.116 J5.119 J5.122 J5.125 J5.128 J5.131 J5.134 J5.137 J5.140 J5.143 J5.146 J5.149 J5.152 J5.155 J5.158 J5.161 J5.164 J5.170
P3V3MP: J5.4
PAYLOAD_PWR: J5.2 J5.9 J5.18 J5.27 J5.42 J5.57 J5.72 J5.84
AMC_En: J5.41 ; port AMC_En
AMC_TCK: J5.165 ; port JTAG.TCK
AMC_TDI: J5.169 ; port JTAG.TDI
AMC_TDO: J5.168 ; port JTAG.TDO
AMC_TMS: J5.166 ; port JTAG.TMS
AMC_TRSTn: J5.167 ; port JTAG.TRSTn
FCLKA_N: J5.81 ; port FABRIC_CLK.FCLKA_N
FCLKA_P: J5.80 ; port FABRIC_CLK.FCLKA_P
GA0: J5.5 ; port ADDRESS.GA0
GA1: J5.17 ; port ADDRESS.GA1
GA2: J5.26 ; port ADDRESS.GA2
IPMB_SCL: J5.56 ; port IPMB.SCL
IPMB_SDA: J5.71 ; port IPMB.SDA
PS0#: D3.1(C) J5.83
PS1#: D3.2(A) J5.3
Rx0_N: J5.15 ; port PORT0.RX0_N
Rx0_P: J5.14 ; port PORT0.RX0_P
Rx2_N: J5.33 ; port PORT2.Rx2_N
Rx2_P: J5.32 ; port PORT2.Rx2_P
Rx3_N: J5.39 ; port PORT3.Rx3_N
Rx3_P: J5.38 ; port PORT3.Rx3_P
Rx4_N: J5.48 ; port FAT_PIPE1.Rx4_N
Rx4_P: J5.47 ; port FAT_PIPE1.Rx4_P
Rx5_N: J5.54 ; port FAT_PIPE1.Rx5_N
Rx5_P: J5.53 ; port FAT_PIPE1.Rx5_P
Rx6_N: J5.63 ; port FAT_PIPE1.Rx6_N
Rx6_P: J5.62 ; port FAT_PIPE1.Rx6_P
Rx7_N: J5.69 ; port FAT_PIPE1.Rx7_N
Rx7_P: J5.68 ; port FAT_PIPE1.Rx7_P
Rx8_N: J5.87 ; port FAT_PIPE2.Rx8_N
Rx8_P: J5.88 ; port FAT_PIPE2.Rx8_P
Rx9_N: J5.93 ; port FAT_PIPE2.Rx9_N
Rx9_P: J5.94 ; port FAT_PIPE2.Rx9_P
Rx10_N: J5.99 ; port FAT_PIPE2.Rx10_N
Rx10_P: J5.100 ; port FAT_PIPE2.Rx10_P
Rx11_N: J5.105 ; port FAT_PIPE2.Rx11_N
Rx11_P: J5.106 ; port FAT_PIPE2.Rx11_P
Rx12_N: J5.111 ; port AMC_P2P.Rx12_N
Rx12_P: J5.112 ; port AMC_P2P.Rx12_P
Rx13_N: J5.117 ; port AMC_P2P.Rx13_N
Rx13_P: J5.118 ; port AMC_P2P.Rx13_P
Rx14_N: J5.123 ; port AMC_P2P.Rx14_N
Rx14_P: J5.124 ; port AMC_P2P.Rx14_P
Rx15_N: J5.129 ; port AMC_P2P.Rx15_N
Rx15_P: J5.130 ; port AMC_P2P.Rx15_P
Rx17_N: J5.141 ; port MLVDS.Rx17_N
Rx17_P: J5.142 ; port MLVDS.Rx17_P
Rx18_N: J5.147 ; port MLVDS.Rx18_N
Rx18_P: J5.148 ; port MLVDS.Rx18_P
Rx19_N: J5.153 ; port MLVDS.Rx19_N
Rx19_P: J5.154 ; port MLVDS.Rx19_P
Rx20_N: J5.159 ; port MLVDS.Rx20_N
Rx20_P: J5.160 ; port MLVDS.Rx20_P
TCLKA_N: J5.75 ; port TELECOM_CLK.TCLKA_N
TCLKA_P: J5.74 ; port TELECOM_CLK.TCLKA_P
TCLKB_N: J5.78 ; port TELECOM_CLK.TCLKB_N
TCLKB_P: J5.77 ; port TELECOM_CLK.TCLKB_P
TCLKC_N: J5.135 ; port TELECOM_CLK.TCLKC_N
TCLKC_P: J5.136 ; port TELECOM_CLK.TCLKC_P
TCLKD_N: J5.138 ; port TELECOM_CLK.TCLKD_N
TCLKD_P: J5.139 ; port TELECOM_CLK.TCLKD_P
Tx0_N: J5.12 ; port PORT0.TX0_N
Tx0_P: J5.11 ; port PORT0.TX0_P
Tx2_N: J5.30 ; port PORT2.Tx2_N
Tx2_P: J5.29 ; port PORT2.Tx2_P
Tx3_N: J5.36 ; port PORT3.Tx3_N
Tx3_P: J5.35 ; port PORT3.Tx3_P
Tx4_N: J5.45 ; port FAT_PIPE1.Tx4_N
Tx4_P: J5.44 ; port FAT_PIPE1.Tx4_P
Tx5_N: J5.51 ; port FAT_PIPE1.Tx5_N
Tx5_P: J5.50 ; port FAT_PIPE1.Tx5_P
Tx6_N: J5.60 ; port FAT_PIPE1.Tx6_N
Tx6_P: J5.59 ; port FAT_PIPE1.Tx6_P
Tx7_N: J5.66 ; port FAT_PIPE1.Tx7_N
Tx7_P: J5.65 ; port FAT_PIPE1.Tx7_P
Tx8_N: J5.90 ; port FAT_PIPE2.Tx8_N
Tx8_P: J5.91 ; port FAT_PIPE2.Tx8_P
Tx9_N: J5.96 ; port FAT_PIPE2.Tx9_N
Tx9_P: J5.97 ; port FAT_PIPE2.Tx9_P
Tx10_N: J5.102 ; port FAT_PIPE2.Tx10_N
Tx10_P: J5.103 ; port FAT_PIPE2.Tx10_P
Tx11_N: J5.108 ; port FAT_PIPE2.Tx11_N
Tx11_P: J5.109 ; port FAT_PIPE2.Tx11_P
Tx12_N: J5.114 ; port AMC_P2P.Tx12_N
Tx12_P: J5.115 ; port AMC_P2P.Tx12_P
Tx13_N: J5.120 ; port AMC_P2P.Tx13_N
Tx13_P: J5.121 ; port AMC_P2P.Tx13_P
Tx14_N: J5.126 ; port AMC_P2P.Tx14_N
Tx14_P: J5.127 ; port AMC_P2P.Tx14_P
Tx15_N: J5.132 ; port AMC_P2P.Tx15_N
Tx15_P: J5.133 ; port AMC_P2P.Tx15_P
Tx17_N: J5.144 ; port MLVDS.Tx17_N
Tx17_P: J5.145 ; port MLVDS.Tx17_P
Tx18_N: J5.150 ; port MLVDS.Tx18_N
Tx18_P: J5.151 ; port MLVDS.Tx18_P
Tx19_N: J5.156 ; port MLVDS.Tx19_N
Tx19_P: J5.157 ; port MLVDS.Tx19_P
Tx20_N: J5.162 ; port MLVDS.Tx20_N
Tx20_P: J5.163 ; port MLVDS.Tx20_P

Not connected (* = marked no-connect by the designer): J5 6 8 20 21 23 24 171 172 173 174 175 176 177 178 179 180 181 182 183 184 185 186 187 188 189 190 191 192 193 194 195 196 197 198 199 200 201 202 203 204 205 206 207 208 209 210 211 212 213 214 215 216 217 218 219 220 221 222 223 224 225 226 227 228 229 230 231 232 233 234 235 236 237 238 239 240 241 242 243 244 245 246 247 248 249 250 251 252 253 254 255 256 257 258 259 260 261 262 263 264 265 266 267 268 269 270 271 272 273 274

### Layout directives
differential pair: FCLKA_N, FCLKA_P, Rx0_N, Rx0_P, Rx2_N, Rx2_P, Rx3_N, Rx3_P, Rx4_N, Rx4_P, Rx5_N, Rx5_P, Rx6_N, Rx6_P, Rx7_N, Rx7_P, Rx8_N, Rx8_P, Rx9_N, Rx9_P, Rx10_N, Rx10_P, Rx11_N, Rx11_P, Rx12_N, Rx12_P, Rx13_N, Rx13_P, Rx14_N, Rx14_P, Rx15_N, Rx15_P, Rx17_N, Rx17_P, Rx18_N, Rx18_P, Rx19_N, Rx19_P, Rx20_N, Rx20_P, TCLKA_N, TCLKA_P, TCLKB_N, TCLKB_P, TCLKC_N, TCLKC_P, TCLKD_N, TCLKD_P, Tx0_N, Tx0_P, Tx2_N, Tx2_P, Tx3_N, Tx3_P, Tx4_N, Tx4_P, Tx5_N, Tx5_P, Tx6_N, Tx6_P, Tx7_N, Tx7_P, Tx8_N, Tx8_P, Tx9_N, Tx9_P, Tx10_N, Tx10_P, Tx11_N, Tx11_P, Tx12_N, Tx12_P, Tx13_N, Tx13_P, Tx14_N, Tx14_P, Tx15_N, Tx15_P, Tx17_N, Tx17_P, Tx18_N, Tx18_P, Tx19_N, Tx19_P, Tx20_N, Tx20_P

### Notes on the sheet
- - Dimensions are in MM, nominal values used
- - Stackup is not specified in AMC Base Specification.PDF or implemented in this template.
- Page 59
- - The two corners of outline near the edge-connector are approximated, see AMC Base Specification.PDF,
- - Component height rule derived from AMC Base Specification.PDF, Page 62
- Project/Equipment
- Document
- Designer
- Drawn by
- Check.by
- Copyright WUT ISE 2018.
  This documentation describes Open Hardware and is licensed under the CERN OHL v.1.1. You may redistribute and modify this documentation under the terms of the CERN OHL v.1.1. (http://ohwr.org/CERNOHL). This documentation is distributed WITHOUT ANY EXPRESS OR IMPLIED WARRANTY, INCLUDING OF MERCHANTABILITY, SATISFACTORY QUALITY AND FITNESS FOR A PARTICULAR PURPOSE. Please see the CERN OHL v.1.1 for applicable conditions.
- Contact
- File
- Last Mod.
- Print Date
- Sheet
- Size
- A3
- of
- Rev

### Library data of the parts
D3 = BAT165: as D2 on sheet USB_SERIAL_QUAD; Manufacturer Part Number: BAT165; PackageDescription: Small Outline Diode (SOD-323), 1.70mm W X 1.25mm L X 1.10mm H body,  IPC Medium Density; Part Number: BAT165; Component Kind: Standard; Component Type: Standard; Device: BAT165; Pin Count: 2; Case: SOD323; Mounted: Yes; Socket: No; SMD: Yes; Sense: No; ComponentHeight: 1.1mm; HelpURL: \\cern.ch\dfs\Applications\Altium\Datasheets\BAT165.pdf; Author: CERN DEM JLC; CreateDate: 12.11.2014; LatestRevisionDate: 12.11.2014
J5 = (no symbol name): Manufacturer Part Number: pcb; Part Description: pcb connector; $$Internal_Resolution: 00001mm; Cell Name: AMC-GF-2D-750-O274; CmpIndex: 2; DXDB_LIBNAME: MISC_GK; Ref Designator: J5; SymIndex: 1622; $$Internal___BlkDate: 11:12:18_11-07-16; Manufacturer: pcb; Part Name: AMC_CON_PCB; Part Number: AMC_CON_PCB; Orientation: 0 = 0